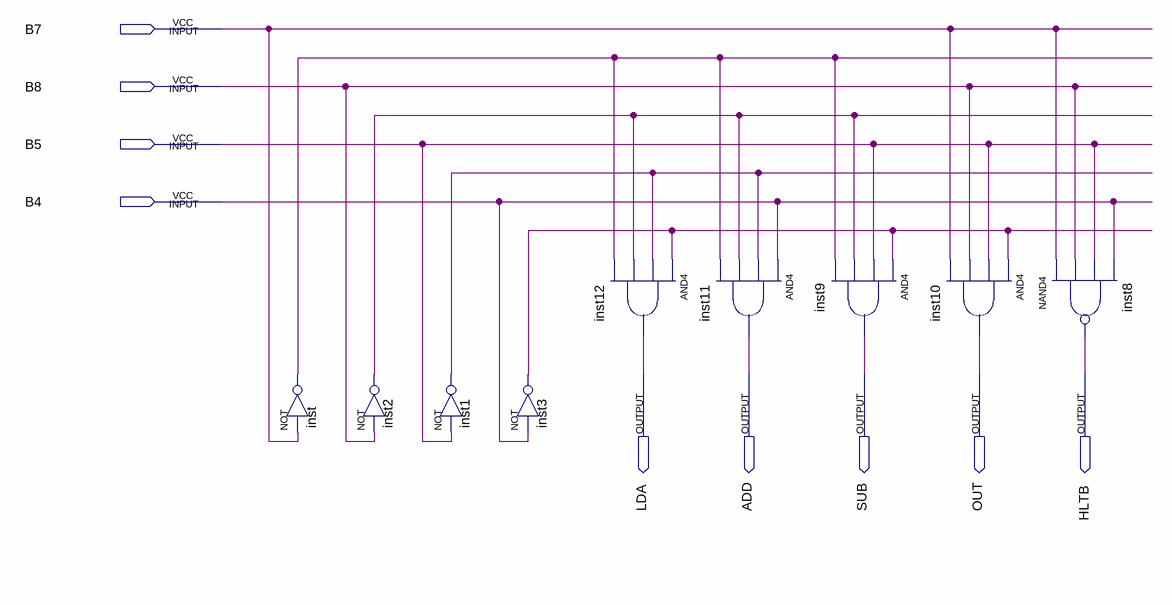
[diagram p0: schematic sheet]
// Quartus schematic Decodificador.bdf as structural Verilog: 9 symbols, 9 pins
module Decodificador (
  input  B7,
  input  B8,
  input  B5,
  input  B4,
  output LDA,
  output ADD,
  output SUB,
  output OUT,
  output HLTB
);

  wire inst1_out, inst2_out, inst3_out, inst_out;

  not inst (inst_out, B7);
  not inst2 (inst2_out, B8);
  not inst1 (inst1_out, B5);
  not inst3 (inst3_out, B4);
  and inst12 (LDA, inst3_out, inst1_out, inst2_out, inst_out);
  and inst11 (ADD, B4, inst1_out, inst2_out, inst_out);
  and inst9 (SUB, inst3_out, B5, inst2_out, inst_out);
  and inst10 (OUT, inst3_out, B5, B8, B7);
  nand inst8 (HLTB, B7, B8, B5, B4);
endmodule
